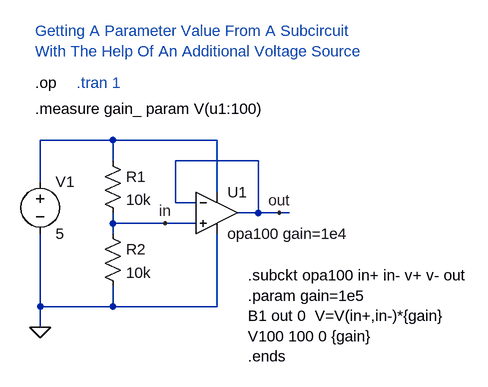
[diagram p0: schematic Parameter_from_subcircuit.asc]
Parameter_from_subcircuit.asc, the LTspice schematic file:
Version 4
SHEET 1 880 680
WIRE 176 64 64 64
WIRE 336 64 176 64
WIRE 176 96 176 64
WIRE 400 96 272 96
WIRE 64 128 64 64
WIRE 336 144 336 64
WIRE 272 160 272 96
WIRE 304 160 272 160
WIRE 400 176 400 96
WIRE 400 176 368 176
WIRE 432 176 400 176
WIRE 448 176 432 176
WIRE 176 192 176 176
WIRE 256 192 176 192
WIRE 304 192 256 192
WIRE 176 208 176 192
WIRE 64 320 64 208
WIRE 176 320 176 288
WIRE 176 320 64 320
WIRE 336 320 336 208
WIRE 336 320 176 320
WIRE 64 352 64 320
FLAG 64 352 0
FLAG 432 176 out
FLAG 256 192 in
SYMBOL voltage 64 112 R0
SYMATTR InstName V1
SYMATTR Value 5
SYMBOL Opamps\\opamp2 336 112 R0
SYMATTR InstName U1
SYMATTR Value opa100 gain=1e4
SYMBOL res 160 80 R0
SYMATTR InstName R1
SYMATTR Value 10k
SYMBOL res 160 192 R0
SYMATTR InstName R2
SYMATTR Value 10k
TEXT 384 272 Left 0 !.subckt opa100 in+ in- v+ v- out\n.param gain=1e5\nB1 out 0  V=V(in+,in-)*{gain}\nV100 100 0 {gain}\n.ends
TEXT 56 -24 Left 0 !.op
TEXT 120 -24 Left 0 ;.tran 1
TEXT 56 16 Left 0 !.measure gain_ param V(u1:100)
TEXT 56 -104 Left 0 ;Getting A Parameter Value From A Subcircuit \nWith The Help Of An Additional Voltage Source

The netlist it stands for:
* Parameter_from_subcircuit.asc
V1 N001 0 5
XU1 in out N001 0 out opa100 gain=1e4  ; pins In+ In- V+ V- OUT
R1 N001 in 10k
R2 in 0 10k
.subckt opa100 in+ in- v+ v- out
.param gain=1e5
B1 out 0  V=V(in+,in-)*{gain}
V100 100 0 {gain}
.ends
.op
* .tran 1
.measure gain_ param V(u1:100)
* Getting A Parameter Value From A Subcircuit
* With The Help Of An Additional Voltage Source
.backanno
.end